# Altium schematic sheet TLD.SchDoc
size A; SheetNumber: 1; SheetTotal: 5
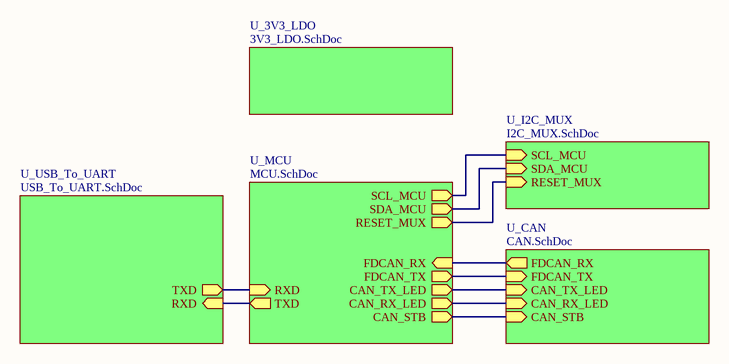
[diagram p0: TLD.SchDoc]

## Sub-sheets
U_3V3_LDO = 3V3_LDO.SchDoc: no entries
U_CAN = CAN.SchDoc: FDCAN_RX (out), FDCAN_TX (in), CAN_TX_LED (in), CAN_RX_LED (in), CAN_STB (in)
U_I2C_MUX = I2C_MUX.SchDoc: SCL_MCU (in), SDA_MCU (in), RESET_MUX (in)
U_MCU = MCU.SchDoc: SCL_MCU (out), SDA_MCU (out), FDCAN_RX (in), FDCAN_TX (out), CAN_RX_LED (out), CAN_TX_LED (out), RESET_MUX (out), TXD (out), RXD (in), CAN_STB (out)
U_USB_To_UART = USB_To_UART.SchDoc: TXD (out), RXD (in)

## Nets
(unnamed): sheet U_CAN/FDCAN_RX, sheet U_MCU/FDCAN_RX
(unnamed): sheet U_CAN/FDCAN_TX, sheet U_MCU/FDCAN_TX
(unnamed): sheet U_CAN/CAN_TX_LED, sheet U_MCU/CAN_TX_LED
(unnamed): sheet U_CAN/CAN_RX_LED, sheet U_MCU/CAN_RX_LED
(unnamed): sheet U_CAN/CAN_STB, sheet U_MCU/CAN_STB
(unnamed): sheet U_I2C_MUX/SCL_MCU, sheet U_MCU/SCL_MCU
(unnamed): sheet U_I2C_MUX/SDA_MCU, sheet U_MCU/SDA_MCU
(unnamed): sheet U_I2C_MUX/RESET_MUX, sheet U_MCU/RESET_MUX
(unnamed): sheet U_MCU/TXD, sheet U_USB_To_UART/RXD
(unnamed): sheet U_MCU/RXD, sheet U_USB_To_UART/TXD